# Altium schematic sheet Top-Level.SchDoc
size A; SheetNumber: 1; SheetTotal: 10
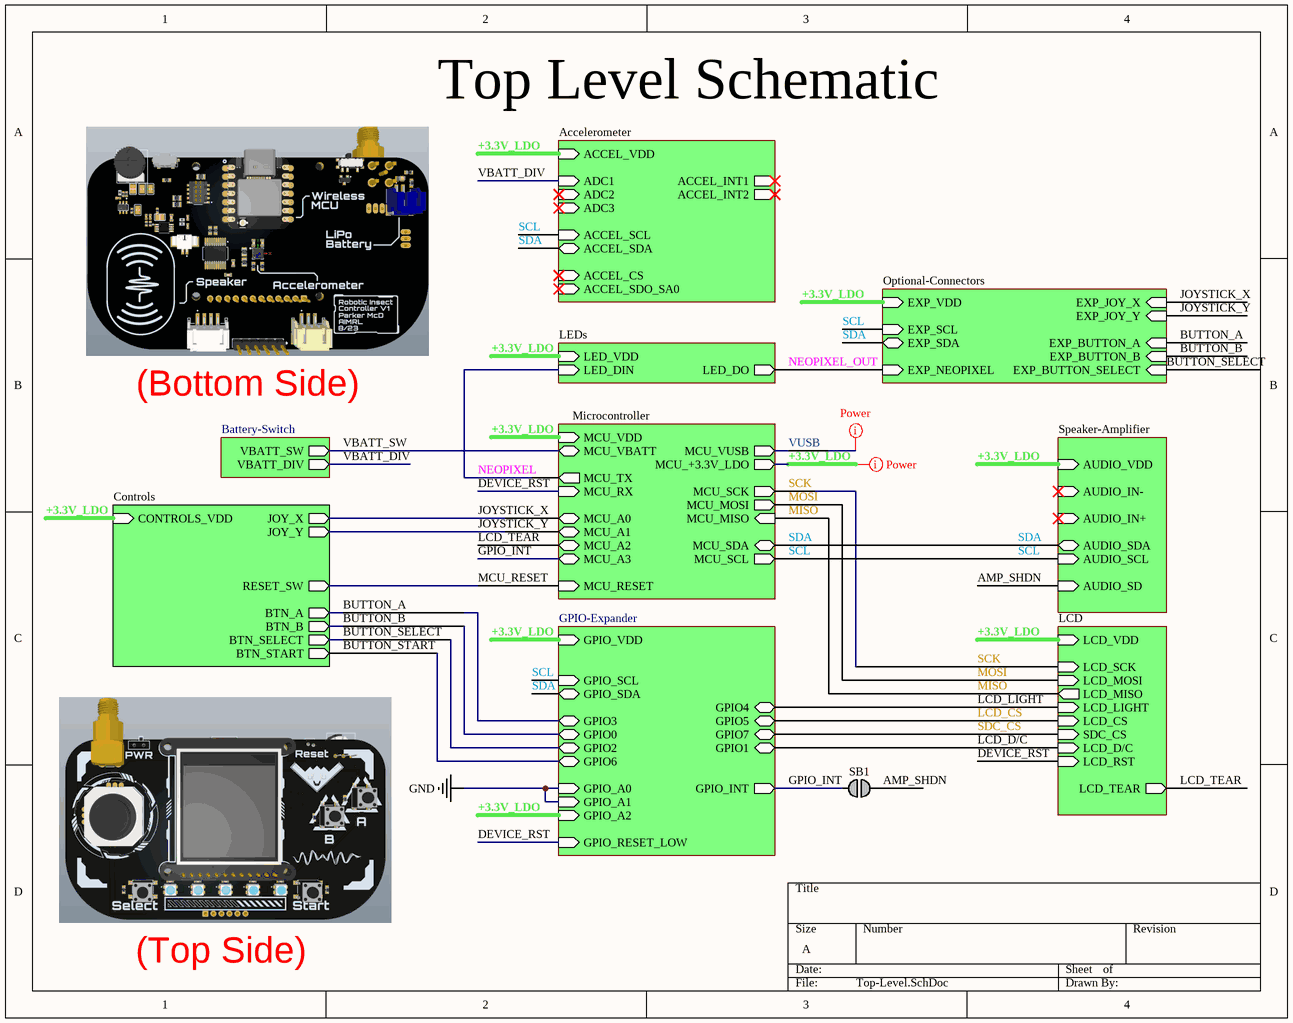
[diagram p0: Top-Level.SchDoc]

## Parts
SB1  SB-OPEN-NO-PASTE  [PCB-SOLDERJUMPER-NOPASTE]  (value not drawn)  (no BOM)

## Sub-sheets
Accelerometer = Accelerometer.SchDoc: ACCEL_SDA (bidir), ACCEL_SCL (in), ACCEL_INT1 (out), ACCEL_INT2 (out), ADC1 (in), ADC2 (in), ADC3 (in), ACCEL_VDD (in), ACCEL_SDO_SA0 (in), ACCEL_CS (in)
Battery-Switch = Battery-Switch.SchDoc: VBATT_DIV (out), VBATT_SW (out)
Controls = Controls.SchDoc: BTN_A (out), BTN_B (out), BTN_SELECT (out), BTN_START (out), JOY_X (out), JOY_Y (out), CONTROLS_VDD (in), RESET_SW (out)
GPIO-Expander = GPIO-Expander.SchDoc: GPIO_SCL (in), GPIO_SDA (bidir), GPIO_RESET_LOW (in), GPIO_INT (out), GPIO_A0 (in), GPIO_A1 (in), GPIO_A2 (in), GPIO_VDD (in), GPIO0 (bidir), GPIO1 (bidir), GPIO2 (bidir), GPIO3 (bidir), GPIO4 (bidir), GPIO5 (bidir), GPIO6 (bidir), GPIO7 (bidir)
LCD = LCD.SchDoc: LCD_MOSI (in), LCD_MISO (out), LCD_SCK (in), LCD_CS (in), LCD_RST (in), LCD_D/C (in), SDC_CS (in), LCD_LIGHT (in), LCD_TEAR (out), LCD_VDD (in)
LEDs = LEDs.SchDoc: LED_DIN (in), LED_DO (out), LED_VDD (in)
Microcontroller = Microcontroller.SchDoc: MCU_RX (in), MCU_TX (out), MCU_SCL (out), MCU_SDA (bidir), MCU_MOSI (out), MCU_MISO (in), MCU_SCK (out), MCU_VUSB (out), MCU_A0 (bidir), MCU_A1 (bidir), MCU_A2 (bidir), MCU_A3 (bidir), MCU_RESET (in), MCU_+3.3V_LDO (out), MCU_VBATT (bidir), MCU_VDD (in)
Optional-Connectors = Optional-Connectors.SchDoc: EXP_SDA (bidir), EXP_SCL (in), EXP_VDD (in), EXP_NEOPIXEL (in), EXP_JOY_X (in), EXP_JOY_Y (in), EXP_BUTTON_A (in), EXP_BUTTON_B (in), EXP_BUTTON_SELECT (in)
Speaker-Amplifier = Speaker-Amplifier.SchDoc: AUDIO_SCL (in), AUDIO_SDA (bidir), AUDIO_VDD (in), AUDIO_SD (in), AUDIO_IN- (in), AUDIO_IN+ (in)

## Nets
GND: sheet GPIO-Expander/GPIO_A0, sheet GPIO-Expander/GPIO_A1
+3.3V_LDO: sheet Accelerometer/ACCEL_VDD, sheet LCD/LCD_VDD, sheet Controls/CONTROLS_VDD, sheet LEDs/LED_VDD, sheet Microcontroller/MCU_+3.3V_LDO, sheet Microcontroller/MCU_VDD, sheet GPIO-Expander/GPIO_A2, sheet GPIO-Expander/GPIO_VDD, sheet Speaker-Amplifier/AUDIO_VDD, sheet Optional-Connectors/EXP_VDD
AMP_SHDN: SB1.1 ; sheet Speaker-Amplifier/AUDIO_SD
BUTTON_A: sheet Controls/BTN_A, sheet GPIO-Expander/GPIO3, sheet Optional-Connectors/EXP_BUTTON_A
BUTTON_B: sheet Controls/BTN_B, sheet GPIO-Expander/GPIO0, sheet Optional-Connectors/EXP_BUTTON_B
BUTTON_SELECT: sheet Controls/BTN_SELECT, sheet GPIO-Expander/GPIO2, sheet Optional-Connectors/EXP_BUTTON_SELECT
BUTTON_START: sheet Controls/BTN_START, sheet GPIO-Expander/GPIO6
DEVICE_RST: sheet LCD/LCD_RST, sheet Microcontroller/MCU_RX, sheet GPIO-Expander/GPIO_RESET_LOW
GPIO_INT: SB1.2 ; sheet Microcontroller/MCU_A3, sheet GPIO-Expander/GPIO_INT
JOYSTICK_X: sheet Controls/JOY_X, sheet Microcontroller/MCU_A0, sheet Optional-Connectors/EXP_JOY_X
JOYSTICK_Y: sheet Controls/JOY_Y, sheet Microcontroller/MCU_A1, sheet Optional-Connectors/EXP_JOY_Y
LCD_CS: sheet LCD/LCD_CS, sheet GPIO-Expander/GPIO5
LCD_D/C: sheet LCD/LCD_D/C, sheet GPIO-Expander/GPIO1
LCD_LIGHT: sheet LCD/LCD_LIGHT, sheet GPIO-Expander/GPIO4
LCD_TEAR: sheet LCD/LCD_TEAR, sheet Microcontroller/MCU_A2
MCU_RESET: sheet Controls/RESET_SW, sheet Microcontroller/MCU_RESET
MISO: sheet LCD/LCD_MISO, sheet Microcontroller/MCU_MISO
MOSI: sheet LCD/LCD_MOSI, sheet Microcontroller/MCU_MOSI
NEOPIXEL: sheet LEDs/LED_DIN, sheet Microcontroller/MCU_TX
NEOPIXEL_OUT: sheet LEDs/LED_DO, sheet Optional-Connectors/EXP_NEOPIXEL
SCK: sheet LCD/LCD_SCK, sheet Microcontroller/MCU_SCK
SCL: sheet Accelerometer/ACCEL_SCL, sheet Microcontroller/MCU_SCL, sheet GPIO-Expander/GPIO_SCL, sheet Speaker-Amplifier/AUDIO_SCL, sheet Optional-Connectors/EXP_SCL
SDA: sheet Accelerometer/ACCEL_SDA, sheet Microcontroller/MCU_SDA, sheet GPIO-Expander/GPIO_SDA, sheet Speaker-Amplifier/AUDIO_SDA, sheet Optional-Connectors/EXP_SDA
SDC_CS: sheet LCD/SDC_CS, sheet GPIO-Expander/GPIO7
VBATT_DIV: sheet Accelerometer/ADC1, sheet Battery-Switch/VBATT_DIV
VBATT_SW: sheet Microcontroller/MCU_VBATT, sheet Battery-Switch/VBATT_SW
VUSB: sheet Microcontroller/MCU_VUSB

## Layout directives
net class Power: +3.3V_LDO, VUSB

## Notes on the sheet
- Top Level Schematic
- (Bottom Side)
- (Top Side)

## Library data of the parts
SB1 = CMP-090-000003-4: Solder bridge, normally open, no solder paste.